# EAGLE design mach2_breakout_v2 (EAGLE 6.5.0)
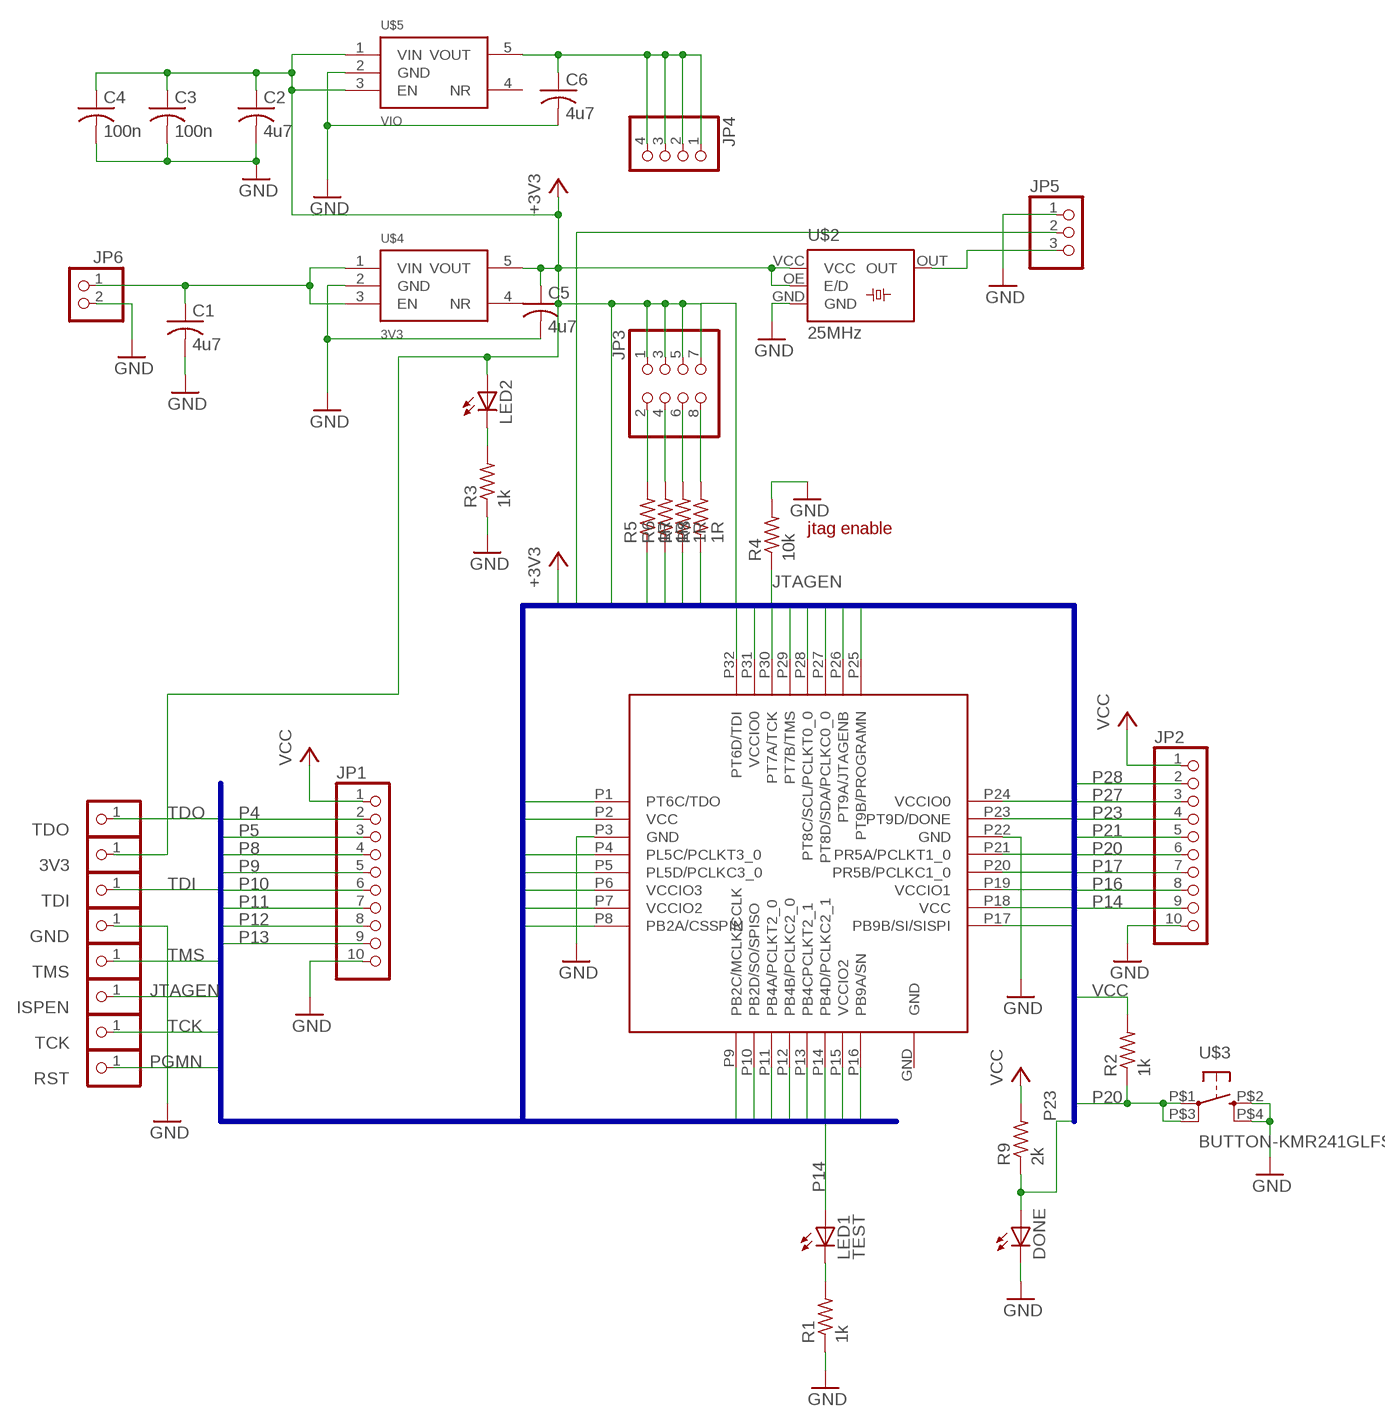
[diagram p0: schematic, sheet 1]

## Parts
3V3  PINHD-1X1  [1X01]
C1  4u7  C-USC0603  [C0603]
C2  4u7  C-USC0603  [C0603]
C3  100n  C-USC0603  [C0603]
C4  100n  C-USC0603  [C0603]
C5  4u7  C-USC0603  [C0603]
C6  4u7  C-USC0603  [C0603]
DONE  LEDCHIPLED_0603  [CHIPLED_0603]
GND  PINHD-1X1  [1X01]
ISPEN  PINHD-1X1  [1X01]
JP1  PINHD-1X10  [1X10]
JP2  PINHD-1X10  [1X10]
JP3  PINHD-2X4V  [2X04]
JP4  PINHD-1X4  [1X04]
JP5  PINHD-1X3  [1X03]
JP6  PINHD-1X2  [1X02]
LED1  TEST  LEDCHIPLED_0603  [CHIPLED_0603]
LED2  LEDCHIPLED_0603  [CHIPLED_0603]
R1  1k  R-US_R0603  [R0603]
R2  1k  R-US_R0603  [R0603]
R3  1k  R-US_R0603  [R0603]
R4  10k  R-US_R0603  [R0603]
R5  1R  R-US_R0805  [R0805]
R6  1R  R-US_R0805  [R0805]
R7  1R  R-US_R0805  [R0805]
R8  1R  R-US_R0805  [R0805]
R9  2k  R-US_R0603  [R0603]
RST  PINHD-1X1  [1X01]
TCK  PINHD-1X1  [1X01]
TDI  PINHD-1X1  [1X01]
TDO  PINHD-1X1  [1X01]
TMS  PINHD-1X1  [1X01]
U$1  XO2-256  LCMXO2-256  [QFN32]
U$2  25MHz  FXO_HC533225  [FXO_3225]
U$3  BUTTON-KMR241GLFS  [PUSHBUTTON-KMR241GLFS]
U$4  3V3  MIC5317  [SOT23-5]
U$5  VIO  MIC5317  [SOT23-5]

## Nets
GND: C1.2 C2.2 C3.2 C4.2 C5.2 C6.2 DONE.C GND.1 JP1.10 JP2.10 JP5.1 JP6.2 R1.1 R3.1 R4.2 U$1.P3(GND) U$1.P22(GND) U$2.GND U$3.P$2 U$3.P$4 U$4.2(GND) U$5.2(GND)
JTAGEN: ISPEN.1 R4.1 U$1.P26(PT9A/JTAGENB)
N$1: C1.1 JP6.1 U$4.1(VIN) U$4.3(EN)
N$2: JP5.3 U$2.OUT
N$3: LED1.C R1.2
N$4: JP3.8 R8.2
N$5: LED2.C R3.2
N$6: C6.1 JP4.1 JP4.2 JP4.3 JP4.4 U$5.5(VOUT)
N$8: JP3.6 R7.2
N$9: JP3.4 R6.2
N$10: JP3.2 R5.2
P4: JP1.2 JP5.2 U$1.P4(PL5C/PCLKT3_0)
P5: JP1.3 U$1.P5(PL5D/PCLKC3_0)
P8: JP1.4 U$1.P8(PB2A/CSSPIN)
P9: JP1.5 U$1.P9(PB2C/MCLK/CCLK)
P10: JP1.6 U$1.P10(PB2D/SO/SPISO)
P11: JP1.7 U$1.P11(PB4A/PCLKT2_0)
P12: JP1.8 U$1.P12(PB4B/PCLKC2_0)
P13: JP1.9 U$1.P13(PB4CPCLKT2_1)
P14: JP2.9 LED1.A U$1.P14(PB4D/PCLKC2_1)
P16: JP2.8 U$1.P16(PB9A/SN)
P17: JP2.7 U$1.P17(PB9B/SI/SISPI)
P20: JP2.6 R2.1 U$1.P20(PR5B/PCLKC1_0) U$3.P$1 U$3.P$3
P21: JP2.5 U$1.P21(PR5A/PCLKT1_0)
P23: DONE.A JP2.4 R9.1 U$1.P23(PT9D/DONE)
P27: JP2.3 U$1.P27(PT8D/SDA/PCLKC0_0)
P28: JP2.2 U$1.P28(PT8C/SCL/PCLKT0_0)
PGMN: RST.1 U$1.P25(PT9B/PROGRAMN)
TCK: TCK.1 U$1.P30(PT7A/TCK)
TDI: TDI.1 U$1.P32(PT6D/TDI)
TDO: TDO.1 U$1.P1(PT6C/TDO)
TMS: TMS.1 U$1.P29(PT7B/TMS)
VCC: 3V3.1 C2.1 C3.1 C4.1 C5.1 JP1.1 JP2.1 JP3.1 JP3.3 JP3.5 JP3.7 LED2.A R2.2 R9.2 U$1.P2(VCC) U$1.P18(VCC) U$2.OE(E/D) U$2.VCC U$4.5(VOUT) U$5.1(VIN) U$5.3(EN) ; supply symbol labelled +3V3
VCCIO0: R5.1 U$1.P24(VCCIO0) U$1.P31(VCCIO0)
VCCIO1: R6.1 U$1.P19(VCCIO1)
VCCIO2: R7.1 U$1.P7(VCCIO2) U$1.P15(VCCIO2)
VCCIO3: R8.1 U$1.P6(VCCIO3)
Unconnected: U$1.GND U$4.4(NR) U$5.4(NR)

## Buses
P[1..32],VCC,VCCIO[0..3],TDO,TDI,TCK,TMS,PGMN,JTAGEN

## Notes on the sheet
- jtag enable

## Library data of the parts
3V3 GND ISPEN RST TCK TDI TDO TMS = pinhead:PINHD-1X1: PIN HEADER
C1-C6 = resistor:C-US: CAPACITOR, American symbol
DONE LED1 LED2 = led:LED: LED OSRAM: - CHIPLED LG R971, LG N971, LY N971, LG Q971, LY Q971, LO R971, LY R971 LH N974, LH R974 LS Q976, LO Q976, LY Q976 LO Q996 - Hyper CHIPLED LW Q18S LB Q993, LB Q99A, LB R99A - SideLED LS A670, LO A670, LY A670, LG A670, LP A670 LB A673, LV A673, LT A673, LW A673 LH A674 LY A675 LS A676, LA A676, LO A676, LY A676, LW A676 LS A679, LY A679, LG A679 - Hyper Micro SIDELED® LS Y876, LA Y876, LO Y876, LY Y876 LT Y87S - SmartLED LW L88C, LW L88S LB L89C, LB L89S, LG L890 LS L89K, LO L89K, LY L89K LS L896, LA L896, LO L896, LY L896 - TOPLED LS T670, LO T670, LY T670, LG T670, LP T670 LSG T670, LSP T670, LSY T670, LOP T670, LYG T670 LG T671, LOG T671, LSG T671 LB T673, LV T673, LT T673, LW T673 LH T674 LS T676, LA T676, LO T676, LY T676, LB T676, LH T676, LSB T676, LW T676 LB T67C, LV T67C, LT T67C, LS T67K, LO T67K, LY T67K, LW E67C LS E67B, LA E67B, LO E67B, LY E67B, LB E67C, LV E67C, LT E67C LW T67C LS T679, LY T679, LG T679 LS T770, LO T770, LY T770, LG T770, LP T770 LB T773, LV T773, LT T773, LW T773 LH T774 LS E675, LA E675, LY E675, LS T675 LS T776, LA T776, LO T776, LY T776, LB T776 LHGB T686 LT T68C, LB T68C - Hyper Mini TOPLED® LB M676 - Mini TOPLED Santana® LG M470 LS M47K, LO M47K, LY M47K Source: http://www.osram.convergy.de LUXEON: - LUMILED® LXK2-PW12-R00, LXK2-PW12-S00, LXK2-PW14-U00, LXK2-PW14-V00 LXK2-PM12-R00, LXK2-PM12-S00, LXK2-PM14-U00 LXK2-PE12-Q00, LXK2-PE12-R00, LXK2-PE12-S00, LXK2-PE14-T00, LXK2-PE14-U00 LXK2-PB12-K00, LXK2-PB12-L00, LXK2-PB12-M00, LXK2-PB14-N00, LXK2-PB14-P00, LXK2-PB14-Q00 LXK2-PR12-L00, LXK2-PR12-M00, LXK2-PR14-Q00, LXK2-PR14-R00 LXK2-PD12-Q00, LXK2-PD12-R00, LXK2-PD12-S00 LXK2-PH12-R00, LXK2-PH12-S00 LXK2-PL12-P00, LXK2-PL12-Q00, LXK2-PL12-R00 Source: www.luxeon.com KINGBRIGHT: KA-3528ASYC Source: www.kingbright.com
JP1 JP2 = pinhead:PINHD-1X10: PIN HEADER
JP3 = pinhead:PINHD-2X4: PIN HEADER
JP4 = pinhead:PINHD-1X4: PIN HEADER
JP5 = pinhead:PINHD-1X3: PIN HEADER
JP6 = pinhead:PINHD-1X2: PIN HEADER
R1-R9 = resistor:R-US_: RESISTOR, American symbol
U$1 = AMJ:LCMXO2-256: Lattice Mach XO2 in QFN32 package
U$2 = AMJ:FXO_HC53: FXO HC53 http://www.foxonline.com/pdfs/FXO_HC53.pdf
U$3 = AMJ:BUTTON-KMR241GLFS
U$4 U$5 = AMJ:MIC5317: LDO micrel

## Board
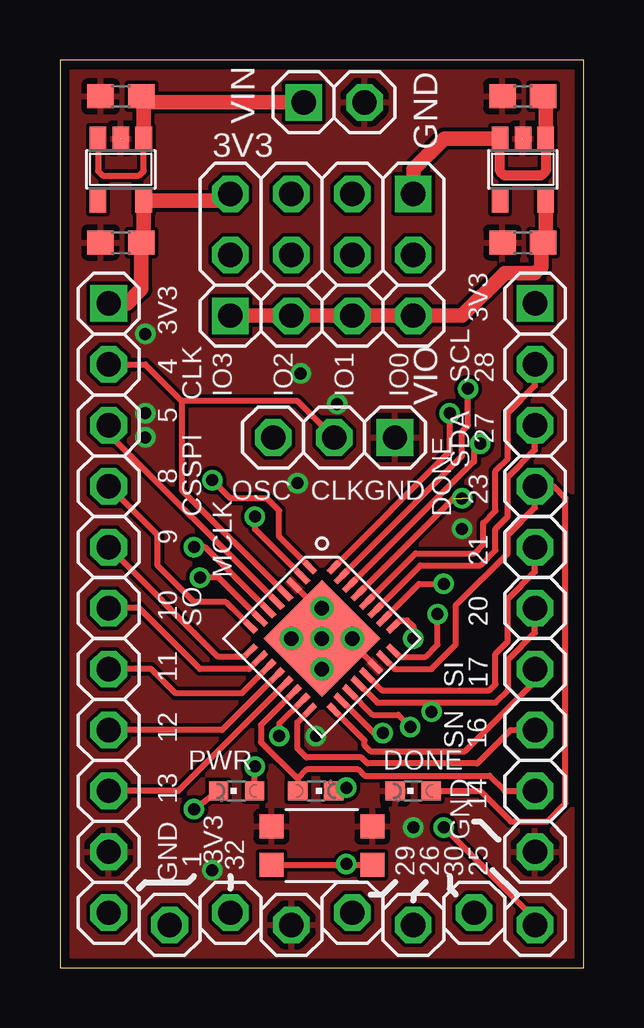
[diagram p1: board, top side]
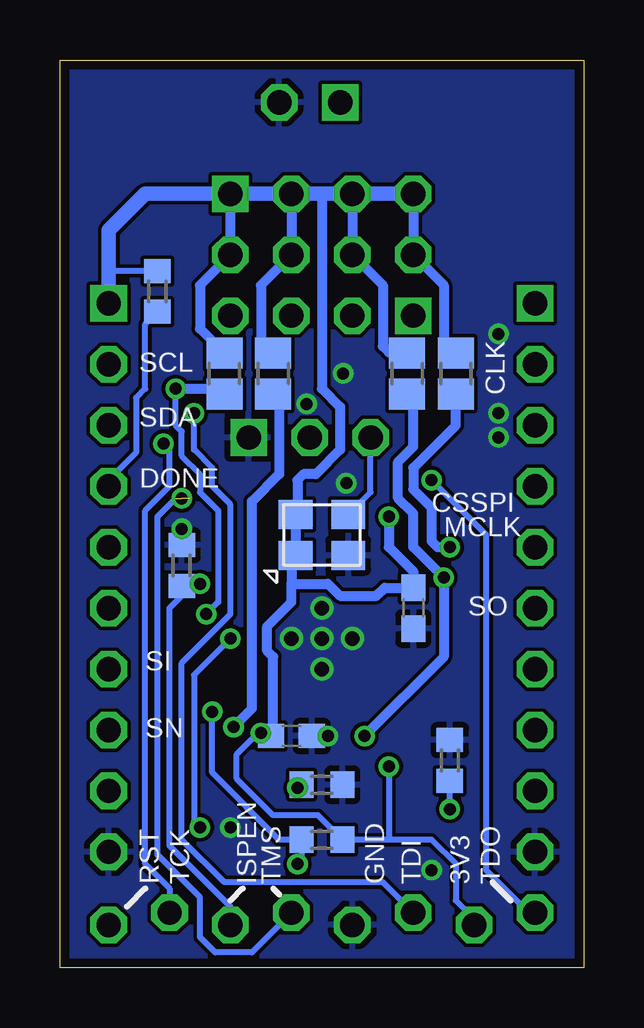
[diagram p2: board, bottom side, seen from below]

Size 21.84 x 37.84 mm. Coordinates in mm from the lower left corner, seen from the top.
Outline: 0,0 21.84,0 21.84,37.84 0,37.84 0,0
Copper layers (1*16): Top 0.0356mm / dielectric 1.5011mm / Bottom 0.0356mm
Design rules "LaenPCBOrder": minimum track width 6mil, minimum drill 13mil, track to track 6mil, track to pad 6mil, pad to pad 6mil, via to via 6mil, smd to smd 6mil, copper to edge 15mil, drill to drill 6mil, minimum pad ring 7mil, minimum via ring 7mil, stop-mask expansion 4mil, vias tented up to drill 20mil, thermal gap 10mil

### Footprints (pad centres in the part's own frame; a part is rotated, then mirrored left to right if it is on the bottom)
1X01 = drill 1.016 octagon: 1 0,0
C0603 = smd 1.1 x 1: 1 -0.85,0; 2 0.85,0
CHIPLED_0603 = smd 0.8 x 0.8: A 0,-0.75; C 0,0.75
1X10 = drill 1.016 square: 1 -11.43,0 | drill 1.016 octagon: 2 -8.89,0; 3 -6.35,0; 4 -3.81,0; 5 -1.27,0; 6 1.27,0; 7 3.81,0; 8 6.35,0; 9 8.89,0; 10 11.43,0
2X04 = drill 1.016 square: 1 -3.81,-1.27 | drill 1.016 octagon: 2 -3.81,1.27; 3 -1.27,-1.27; 4 -1.27,1.27; 5 1.27,-1.27; 6 1.27,1.27; 7 3.81,-1.27; 8 3.81,1.27
1X04 = drill 1.016 square: 1 -3.81,0 | drill 1.016 octagon: 2 -1.27,0; 3 1.27,0; 4 3.81,0
1X03 = drill 1.016 square: 1 -2.54,0 | drill 1.016 octagon: 2 0,0; 3 2.54,0
1X02 = drill 1.016 square: 1 -1.27,0 | drill 1.016 octagon: 2 1.27,0
R0603 = smd 1 x 1.1: 1 -0.85,0; 2 0.85,0
R0805 = smd 1.3 x 1.5: 1 -0.85,0; 2 0.85,0
QFN32 = smd 3.45 x 3.45: GND 0,0 | smd 0.6 x 0.25: P1 -2.45,1.75; P8 -2.45,-1.75; P17 2.45,-1.75; P24 2.45,1.75 | smd 0.7 x 0.25: P2 -2.4,1.25; P3 -2.4,0.75; P4 -2.4,0.25; P5 -2.4,-0.25; P6 -2.4,-0.75; P7 -2.4,-1.25; P18 2.4,-1.25; P19 2.4,-0.75; P20 2.4,-0.25; P21 2.4,0.25; P22 2.4,0.75; P23 2.4,1.25 | smd 0.25 x 0.6: P9 -1.75,-2.45; P16 1.75,-2.45; P25 1.75,2.45; P32 -1.75,2.45 | smd 0.25 x 0.7: P10 -1.25,-2.4; P11 -0.75,-2.4; P12 -0.25,-2.4; P13 0.25,-2.4; P14 0.75,-2.4; P15 1.25,-2.4; P26 1.25,2.4; P27 0.75,2.4; P28 0.25,2.4; P29 -0.25,2.4; P30 -0.75,2.4; P31 -1.25,2.4
FXO_3225 = smd 1.4 x 1.2: GND 1.1,-0.85; OE -1.1,-0.85; OUT 1.1,0.85; VCC -1.1,0.85
PUSHBUTTON-KMR241GLFS = smd 1 x 1: P$1 2.1,0.8; P$2 2.1,-0.8; P$3 -2.1,0.8; P$4 -2.1,-0.8
SOT23-5 = smd 0.69 x 0.99: 1 -0.95,-1.29; 2 0,-1.29; 3 0.95,-1.29; 4 0.95,1.3; 5 -0.95,1.3

### Placement (x,y rotation side)
3V3  4.57,1.78 90 top
C1  2.54,36.32 180 top
C2  19.3,36.32 180 top
C3  7.11,14.99 270 bottom
C4  12.19,9.65 0 bottom
C5  2.54,30.23 180 top
C6  19.3,30.23 180 top
DONE  14.73,7.37 90 top
GND  9.65,1.78 90 top
ISPEN  14.73,1.78 90 top
JP1  2.03,16.26 270 top
JP2  19.81,16.26 270 top
JP3  10.92,30.99 180 top
JP4  10.92,27.18 0 top
JP5  11.43,22.1 180 top
JP6  11.43,36.07 0 top
LED1  10.67,7.37 270 top
LED2  7.37,7.37 90 top
R1  10.92,7.62 180 bottom
R2  10.92,5.33 0 bottom
R3  5.59,8.64 270 bottom
R4  16.76,16.76 90 bottom
R5  14.99,24.77 90 bottom
R6  12.95,24.77 90 bottom
R7  7.37,24.77 90 bottom
R8  5.33,24.77 90 bottom
R9  17.78,28.19 90 bottom
RST  19.81,1.78 90 top
TCK  17.27,2.29 90 top
TDI  7.11,2.29 90 top
TDO  2.03,2.29 90 top
TMS  12.19,2.29 90 top
U$1  10.92,13.72 315 top
U$2  10.92,18.03 0 bottom
U$3  10.92,5.08 180 top
U$4  2.54,33.27 180 top
U$5  19.3,33.27 180 top

### Tracks (layer width: path | path; a pad name or v marks a point on that pad's centre or on a via)
GND  (via drill 0.5, 0.6)
  Top 0.254: U$1.P22 12.19,13.51 v12.19,13.72 | U$1.P3 10.71,14.99 v10.92,14.99
  other vias: 10.67,9.65 10.92,13.72 9.65,13.72 10.92,12.45 14.73,5.84 6.35,4.06 16.76,18.29 3.56,26.42 3.56,22.1 10.03,24.77 11.56,23.5 9.91,20.19 3.56,23.11
  pour Top: -0.25,-0.76 22.86,-0.76 22.61,38.61 -0.51,38.61
  pour Bottom: -0.25,-0.76 22.61,-0.76 22.61,38.35 -0.25,38.35
JTAGEN  (via drill 0.5)
  Top 0.254: U$1.P26 14.98,16 v16,16
  Bottom 0.254: ISPEN.1 14.73,2.54 17.27,5.08 17.27,14.99 16.76,15.49 R4.1 16.6,16 v16,16
N$1
  Top 0.254: U$4.3 1.59,33.21 1.78,33.02 3.3,33.02 3.49,33.21 U$4.1
  Top 0.61: JP6.1 3.64,36.07 C1.1 3.49,36.22 U$4.1
N$2
  Bottom 0.254: U$2.OUT 8.89,19.82 JP5.3
N$3  (via drill 0.5)
  Top 0.254: LED1.C v11.94,7.49
  Bottom 0.254: v11.94,7.49 R1.2
N$4
  Bottom 0.406: 7.11,32.26 JP3.8 5.84,28.45 5.84,26.12 R8.2
N$5  (via drill 0.5)
  Top 0.254: LED2.C v5.6,6.6 v5.59,6.6
  Bottom 0.254: v5.59,6.6 R3.2
N$6
  Top 0.61: U$5.5 20.25,30.33 C6.1 20.07,30.14 20.07,29.21 19.81,28.96 18.54,28.96 16.76,27.18 JP4.4 JP4.3 JP4.2 JP4.1
N$8
  Bottom 0.406: 9.65,32.26 JP3.6 8.38,28.45 8.38,25.91 8.13,25.65 7.41,25.65 R7.2
N$9
  Bottom 0.406: 12.19,32.26 JP3.4 13.46,28.45 13.46,26.12 R6.2
N$10
  Bottom 0.406: 14.73,32.26 JP3.2 16,28.45 16,26.63 R5.2
P4
  Top 0.254: U$1.P4 5.08,19.91 5.08,23.62 | JP1.2 3.56,25.15 5.08,23.62 | JP5.2 9.91,23.62 5.08,23.62
P5
  Top 0.254: U$1.P5 2.03,22.25 JP1.3
P8
  Top 0.254: U$1.P8 7.18,14.99 6.92,15.24 5.59,15.24 4.06,16.76 4.06,18.03 JP1.4
P9
  Top 0.254: U$1.P9 7.68,12.95 6.6,12.95 JP1.5
P10
  Top 0.254: U$1.P10 7.88,12.45 5.84,12.45 3.3,14.99 JP1.6
P11
  Top 0.254: JP1.7 3.81,12.45 4.83,11.43 7.58,11.43 U$1.P11
P12
  Top 0.254: JP1.8 6.76,9.91 U$1.P12
P13
  Top 0.254: U$1.P13 4.93,7.37 JP1.9
P14
  Top 0.254: U$1.P14 8.38,10.12 8.38,9.4 9.92,7.86 | JP2.9 18.54,7.37 17.91,8 12.7,8 12.45,8.26 10.29,8.26 9.92,7.89 9.92,7.86 | 9.92,7.86 LED1.A 9.92,7.35
P16
  Top 0.254: U$1.P16 9.91,10.22 9.91,9.14 10.29,8.76 12.57,8.76 12.83,8.51 17.4,8.51 18.8,9.91 JP2.8
P17
  Top 0.254: JP2.7 19.81,11.94 16.89,9.02 12.95,9.02 12.7,9.27 12.7,9.46 U$1.P17
P20  (via drill 0.5)
  Top 0.254: U$3.P$1 11.94,4.28 | 11.94,4.28 U$3.P$3 | v11.94,4.32 11.94,4.28 | U$1.P20 13.23,11.05 15.49,11.05 | 15.49,11.05 18.16,11.05 18.67,11.56 18.67,12.83 19.81,13.97 JP2.6 | v15.49,10.67 15.49,11.05
  Bottom 0.254: v11.94,4.32 11.77,4.48 R2.1 12.7,5.33 15.49,8.13 v15.49,10.67
P21
  Top 0.254: U$1.P21 13.44,11.56 17.91,11.56 18.16,11.81 18.16,13.08 18.67,13.59 18.67,15.37 19.81,16.51 JP2.5
P23
  Top 0.254: U$1.P23 13.96,12.45 15.49,12.45 16.51,13.46 16.51,15.11 18.67,17.27 18.67,18.03 19.81,19.18 JP2.4 20.57,20.07 21.08,19.56 21.08,6.86 20.32,6.1 18.8,6.1 17.53,7.37 DONE.A
  Bottom 0.254: JP2.4 19.81,20.32 18.67,21.46 18.67,23.75 18.29,24.13 18.29,26.84 R9.1
P27
  Top 0.254: JP2.3 19.81,21.59 18.67,20.45 18.67,18.8 18.16,18.29 18.16,17.4 17.53,16.76 15.03,16.76 U$1.P27
P28
  Top 0.254: JP2.2 19.81,24.26 18.67,23.11 18.67,21.21 18.16,20.7 18.16,19.05 17.65,18.54 17.65,17.65 17.27,17.27 14.83,17.27 U$1.P28
PGMN  (via drill 0.5)
  Top 0.254: U$1.P25 14.16,14.48 14.48,14.48 14.73,14.22 v14.73,13.72 | v16,5.84 19.81,2.03 RST.1
  Bottom 0.254: v14.73,13.72 16.26,12.19 16.26,6.1 v16,5.84
TCK  (via drill 0.5)
  Top 0.254: U$1.P30 17.23,21.08 17.27,21.08 17.27,21.59 v17.53,21.84
  Bottom 0.254: v17.53,21.84 17.27,21.59 17.27,20.07 18.29,19.05 18.29,4.32 17.27,3.3 TCK.1
TDI  (via drill 0.5)
  Top 0.254: U$1.P32 16.26,21.52 v16.26,23.11
  Bottom 0.254: TDI.1 8.38,3.56 14.99,3.56 16.76,5.33 16.76,12.7 14.73,14.73 14.73,19.3 15.49,20.07 15.49,20.83 16.26,21.59 v16.26,23.11
TDO  (via drill 0.5)
  Top 0.254: U$1.P1 9.14,17.97 9.14,19.05 8.64,19.56 7.11,19.56 v6.35,20.32
  Bottom 0.254: TDO.1 2.29,2.29 4.06,4.06 4.06,18.03 v6.35,20.32
TMS  (via drill 0.5)  (2 unrouted)
  Top 0.254: 16.41,19.56 U$1.P29
  Bottom 0.254: TMS.1 13.84,0.64 15.37,0.64 16,1.27 16,2.92 17.78,4.7 17.78,18.8 17.02,19.56
  other vias: 16.76,19.56
VCC  (via drill 0.5)
  Top 0.254: U$1.P2 8.13,18.28 v8.13,18.8 | U$1.P18 13.09,9.78 v13.46,9.78 | LED2.A 8.12,8.37 v8.13,8.38
  Top 0.406: U$5.1 20.25,33.21 20.07,33.02 18.54,33.02 18.35,33.21 U$5.3
  Top 0.61: U$5.3 16.02,34.56 14.73,33.27 JP3.1 | JP1.1 2.79,27.69 3.39,28.28 C5.1 3.49,30.33 U$4.5 6.83,31.97 JP3.7 | C2.1 20.25,36.22 U$5.1
  Bottom 0.254: 8.13,5.33 6.35,5.33 5.33,4.32 5.33,2.79 4.57,2.03 3V3.1 | 8.13,5.33 R2.2 11.09,6.35 12.95,6.35 14.48,7.87 14.48,8.89 13.59,9.78 v13.46,9.78 13.17,9.78 C4.1 | v8.13,8.38 8.13,5.33 | R9.2 19.65,29.04 19.81,29.21
  Bottom 0.406: 12.19,16 12.19,17.01 U$2.OE U$2.VCC 11.94,18.97 11.94,20.32 11.68,20.57 11.18,20.57 10.16,21.59 10.16,23.37 10.92,24.13 10.92,32.26 | 12.19,16 10.67,16 10.16,15.49 8.64,15.49 8.29,15.84 C3.1 7.11,16.51 8.13,17.53 v8.13,18.8 | C4.1 12.95,9.74 12.95,12.95 13.21,13.21 13.21,14.22 12.19,15.24 12.19,16
  Bottom 0.61: JP3.7 JP3.5 10.92,32.26 JP3.3 JP3.1 18.29,32.26 19.81,30.73 19.81,29.21 JP2.1
VCCIO0  (via drill 0.5)
  Top 0.254: U$1.P24 14.16,12.95 15.24,12.95 15.75,13.46 v15.75,14.73 | U$1.P31 16.76,21.33 16.76,22.35 17.02,22.61 v17.02,24.13
  Bottom 0.254: v17.02,24.13 17.02,22.61 16.76,22.35 16.76,21.34 16,20.57 16,19.81 15.24,19.05 15.24,15.24 v15.75,14.73
  Bottom 0.406: v17.02,24.13 15.2,24.13 R5.1
VCCIO1  (via drill 0.5)
  Top 0.254: U$1.P19 13.04,10.54 14.1,10.54 v14.61,10.03
  Bottom 0.406: R6.1 12.95,23.62 12.7,23.37 12.7,20.57 13.84,19.43 13.84,10.79 v14.61,10.03
VCCIO2  (via drill 0.5)
  Top 0.254: U$1.P7 6.61,16.26 v5.84,16.26 | U$1.P15 9.14,10.17 v9.14,9.65
  Bottom 0.406: v9.14,9.65 5.84,12.95 v5.84,16.26 7.11,17.53 7.11,18.92 7.75,19.56 7.75,21.08 7.11,21.72 7.11,23.66 R7.1
VCCIO3  (via drill 0.5)
  Top 0.254: U$1.P6 6.05,17.53 v5.59,17.53
  Bottom 0.406: v5.59,17.53 6.1,17.53 6.35,17.78 6.35,19.18 7.11,19.94 7.11,20.83 5.33,22.61 R8.1

### Text on the board
tPlace: 3V3 | 3V3 | CLK | 4 | SCL | 28 | 5 | 27 | 8 | SDA | CLK | GND | CSSPI | DONE | 23 | 9 | 21 | 10 | MCLK | SO | 20 | 11 | SI | 17 | 12 | SN | 16 | 13 | PWR | 14 | GND | 1 | GND | 3V3 | 32 | 29 | 26 | 30 | 25
bPlace: SCL | CLK | SDA | DONE | CSSPI | MCLK | SO | SI | SN
tNames: VIN | GND | 3V3 | IO3 | IO2 | IO1 | IO0 | VIO | OSC